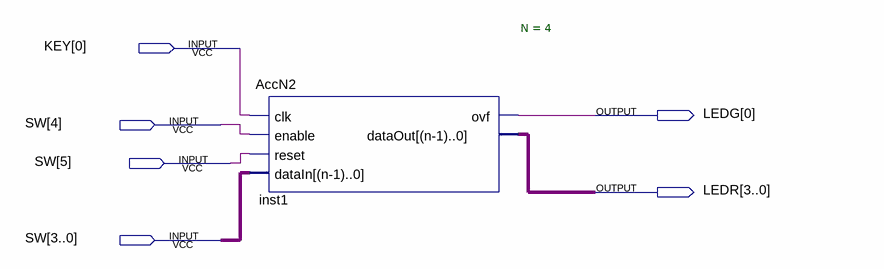
[diagram p0: schematic sheet]
// Quartus schematic AccN_Demo2.bdf as structural Verilog: 1 symbols, 6 pins
module AccN_Demo2 (
  input  [0:0] KEY,
  input  [5:0] SW,
  output [0:0] LEDG,
  output [3:0] LEDR
);

  AccN2 #(.N(4)) inst1 (.clk(KEY[0]), .enable(SW[4]), .reset(SW[5]), .dataIn(SW[3:0]), .ovf(LEDG[0]), .dataOut(LEDR));
endmodule
